# Altium schematic sheet bandwidth_calculation.SchDoc
size A4
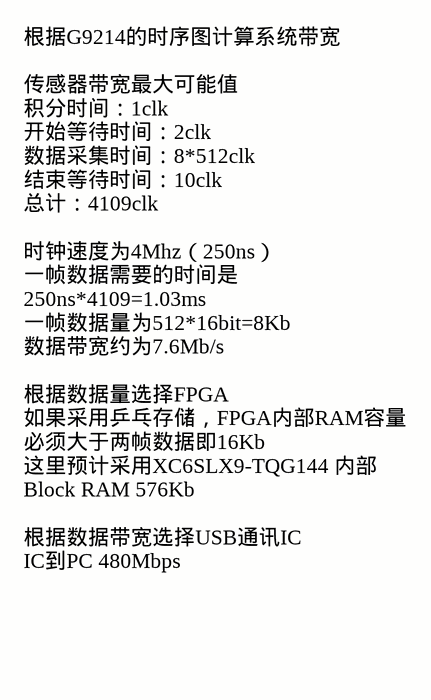
[diagram p0: bandwidth_calculation.SchDoc]

## Notes on the sheet
- 根据G9214的时序图计算系统带宽
  传感器带宽最大可能值
  积分时间：1clk
  开始等待时间：2clk
  数据采集时间：8*512clk
  结束等待时间：10clk
  总计：4109clk
  时钟速度为4Mhz（250ns）
  一帧数据需要的时间是250ns*4109=1.03ms
  一帧数据量为512*16bit=8Kb
  数据带宽约为7.6Mb/s
  根据数据量选择FPGA
  如果采用乒乓存储，FPGA内部RAM容量必须大于两帧数据即16Kb
  这里预计采用XC6SLX9-TQG144 内部Block RAM 576Kb
  根据数据带宽选择USB通讯IC
  IC到PC 480Mbps